# EAGLE design projeto_jcarlos (EAGLE 6.2)
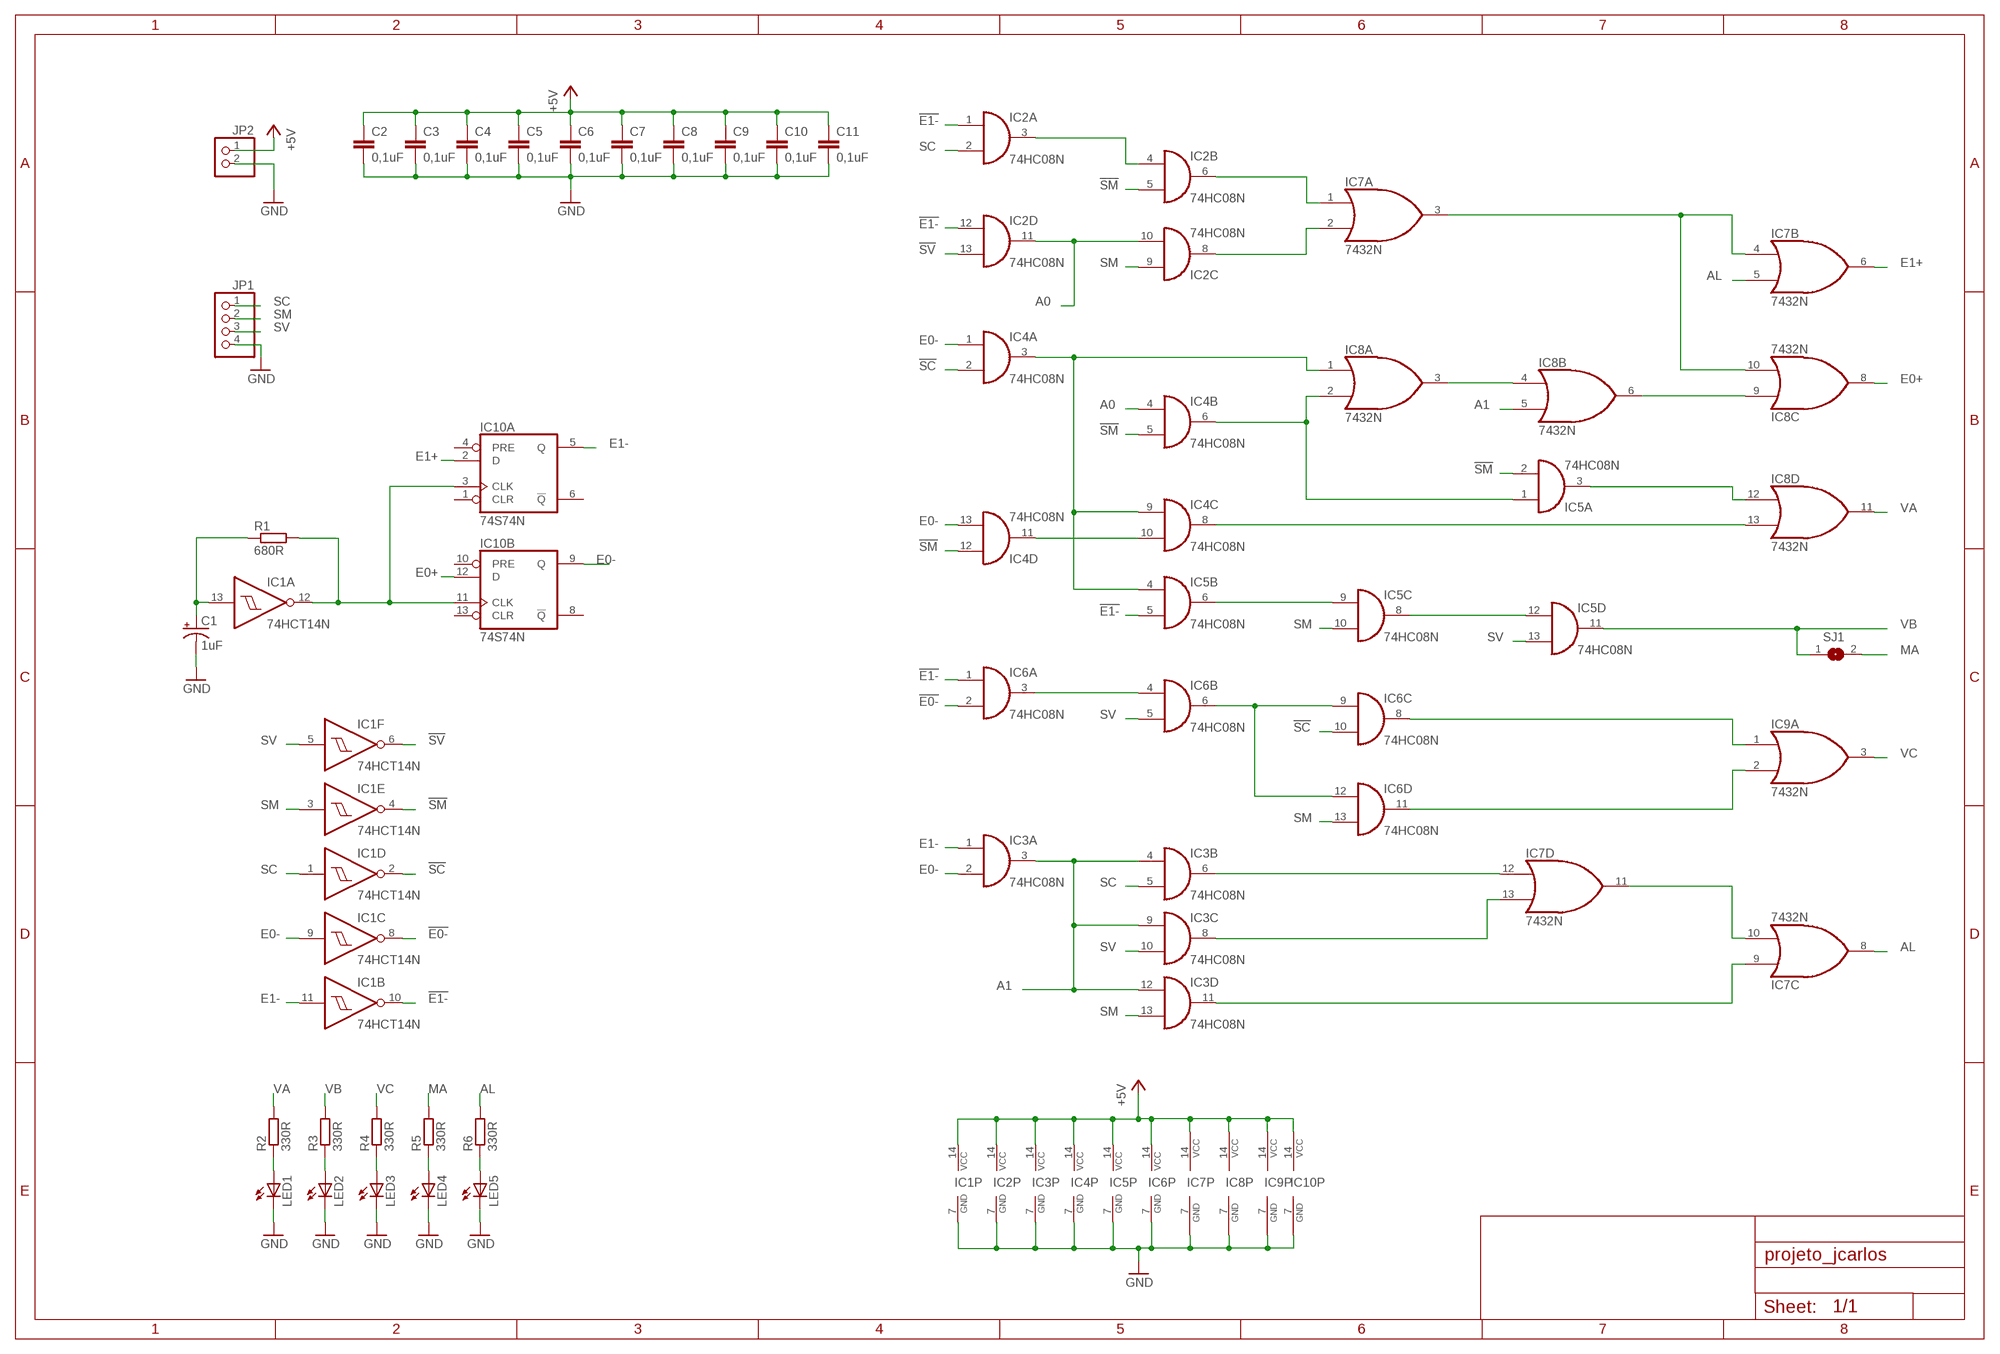
[diagram p0: schematic, sheet 1]

## Parts
C1  1uF  CPOL-USE2.5-5  [E2,5-5]
C2  0,1uF  C-EU025-025X050  [C025-025X050]
C3  0,1uF  C-EU025-025X050  [C025-025X050]
C4  0,1uF  C-EU025-025X050  [C025-025X050]
C5  0,1uF  C-EU025-025X050  [C025-025X050]
C6  0,1uF  C-EU025-025X050  [C025-025X050]
C7  0,1uF  C-EU025-025X050  [C025-025X050]
C8  0,1uF  C-EU025-025X050  [C025-025X050]
C9  0,1uF  C-EU025-025X050  [C025-025X050]
C10  0,1uF  C-EU025-025X050  [C025-025X050]
C11  0,1uF  C-EU025-025X050  [C025-025X050]
IC1  74HCT14N  [DIL14]
IC2  74HC08N  [DIL14]
IC3  74HC08N  [DIL14]
IC4  74HC08N  [DIL14]
IC5  74HC08N  [DIL14]
IC6  74HC08N  [DIL14]
IC7  7432N  [DIL14]
IC8  7432N  [DIL14]
IC9  7432N  [DIL14]
IC10  74S74N  [DIL14]
JP1  PINHD-1X4  [1X04]
JP2  PINHD-1X2  [1X02]
LED1  LED5MM  [LED5MM]
LED2  LED5MM  [LED5MM]
LED3  LED5MM  [LED5MM]
LED4  LED5MM  [LED5MM]
LED5  LED5MM  [LED5MM]
R1  680R  R-EU_0204/5  [0204/5]
R2  330R  R-EU_0204/5  [0204/5]
R3  330R  R-EU_0204/5  [0204/5]
R4  330R  R-EU_0204/5  [0204/5]
R5  330R  R-EU_0204/5  [0204/5]
R6  330R  R-EU_0204/5  [0204/5]
SJ1  SJ  [SJ]

## Nets
!E0-: IC1.8(C:O) IC6.2(A:I1)
!E1-: IC1.10(B:O) IC2.1(A:I0) IC2.12(D:I0) IC5.5(B:I1) IC6.1(A:I0)
!SC: IC1.2(D:O) IC4.2(A:I1) IC6.10(C:I1)
!SM: IC1.4(E:O) IC2.5(B:I1) IC4.5(B:I1) IC4.12(D:I0) IC5.2(A:I1)
!SV: IC1.6(F:O) IC2.13(D:I1)
+5V: C2.1 C3.1 C4.1 C5.1 C6.1 C7.1 C8.1 C9.1 C10.1 C11.1 IC1.14(P:VCC) IC2.14(P:VCC) IC3.14(P:VCC) IC4.14(P:VCC) IC5.14(P:VCC) IC6.14(P:VCC) IC7.14(P:VCC) IC8.14(P:VCC) IC9.14(P:VCC) IC10.14(P:VCC) JP2.1
A0: IC2.10(C:I1) IC2.11(D:O) IC4.4(B:I0)
A1: IC3.3(A:O) IC3.4(B:I0) IC3.9(C:I0) IC3.12(D:I0) IC8.5(B:I1)
AL: IC7.5(B:I1) IC7.8(C:O) R6.2
E0+: IC8.8(C:O) IC10.12(B:D)
E0-: IC1.9(C:I) IC3.2(A:I1) IC4.1(A:I0) IC4.13(D:I1) IC10.9(B:Q)
E1+: IC7.6(B:O) IC10.2(A:D)
E1-: IC1.11(B:I) IC3.1(A:I0) IC10.5(A:Q)
GND: C1.- C2.2 C3.2 C4.2 C5.2 C6.2 C7.2 C8.2 C9.2 C10.2 C11.2 IC1.7(P:GND) IC2.7(P:GND) IC3.7(P:GND) IC4.7(P:GND) IC5.7(P:GND) IC6.7(P:GND) IC7.7(P:GND) IC8.7(P:GND) IC9.7(P:GND) IC10.7(P:GND) JP1.4 JP2.2 LED1.K(C) LED2.K(C) LED3.K(C) LED4.K(C) LED5.K(C)
MA: R5.2 SJ1.2
N$1: IC5.6(B:O) IC5.9(C:I0)
N$2: IC7.3(A:O) IC7.4(B:I0) IC8.10(C:I1)
N$3: IC4.10(C:I1) IC4.11(D:O)
N$4: IC4.8(C:O) IC8.13(D:I1)
N$5: IC8.3(A:O) IC8.4(B:I0)
N$6: IC5.3(A:O) IC8.12(D:I0)
N$7: C1.+ IC1.13(A:I) R1.1
N$8: IC1.12(A:O) IC10.3(A:CLK) IC10.11(B:CLK) R1.2
N$9: IC8.6(B:O) IC8.9(C:I0)
N$10: IC4.3(A:O) IC4.9(C:I0) IC5.4(B:I0) IC8.1(A:I0)
N$11: IC5.8(C:O) IC5.12(D:I0)
N$12: IC4.6(B:O) IC5.1(A:I0) IC8.2(A:I1)
N$13: IC2.3(A:O) IC2.4(B:I0)
N$14: LED1.A R2.1
N$15: IC2.6(B:O) IC7.1(A:I0)
N$16: LED2.A R3.1
N$17: LED3.A R4.1
N$18: IC2.8(C:O) IC7.2(A:I1)
N$19: IC3.6(B:O) IC7.12(D:I0)
N$20: IC3.8(C:O) IC7.13(D:I1)
N$21: IC3.11(D:O) IC7.9(C:I0)
N$22: IC7.10(C:I1) IC7.11(D:O)
N$23: LED4.A R5.1
N$24: LED5.A R6.1
N$27: IC6.3(A:O) IC6.4(B:I0)
N$29: IC6.6(B:O) IC6.9(C:I0) IC6.12(D:I0)
N$32: IC6.8(C:O) IC9.1(A:I0)
N$33: IC6.11(D:O) IC9.2(A:I1)
SC: IC1.1(D:I) IC2.2(A:I1) IC3.5(B:I1) JP1.1
SM: IC1.3(E:I) IC2.9(C:I0) IC3.13(D:I1) IC5.10(C:I1) IC6.13(D:I1) JP1.2
SV: IC1.5(F:I) IC3.10(C:I1) IC5.13(D:I1) IC6.5(B:I1) JP1.3
VA: IC8.11(D:O) R2.2
VB: IC5.11(D:O) R3.2 SJ1.1
VC: IC9.3(A:O) R4.2
Unconnected: IC9.4(B:I0) IC9.5(B:I1) IC9.6(B:O) IC9.8(C:O) IC9.9(C:I0) IC9.10(C:I1) IC9.11(D:O) IC9.12(D:I0) IC9.13(D:I1) IC10.1(A:CLR) IC10.4(A:PRE) IC10.6(A:!Q) IC10.8(B:!Q) IC10.10(B:PRE) IC10.13(B:CLR)

## Library data of the parts
C1 = rcl:CPOL-US: POLARIZED CAPACITOR, American symbol
C2-C11 = rcl:C-EU: CAPACITOR, European symbol
IC1 = 74xx-eu:74*14: Hex schmitt trigger INVERTER
IC2-IC6 = 74xx-eu:74*08: Quad 2-input AND gate
IC7-IC9 = 74xx-us:74*32: Quad 2-input OR gate
IC10 = 74xx-us:74*74: Dual D type positive edge triggered FLIP FLOP, preset and clear
JP1 = pinhead:PINHD-1X4: PIN HEADER
JP2 = pinhead:PINHD-1X2: PIN HEADER
LED1-LED5 = led:LED: LED OSRAM: - CHIPLED LG R971, LG N971, LY N971, LG Q971, LY Q971, LO R971, LY R971 LH N974, LH R974 LS Q976, LO Q976, LY Q976 LO Q996 - Hyper CHIPLED LW Q18S LB Q993, LB Q99A, LB R99A - SideLED LS A670, LO A670, LY A670, LG A670, LP A670 LB A673, LV A673, LT A673, LW A673 LH A674 LY A675 LS A676, LA A676, LO A676, LY A676, LW A676 LS A679, LY A679, LG A679 - Hyper Micro SIDELED® LS Y876, LA Y876, LO Y876, LY Y876 LT Y87S - SmartLED LW L88C, LW L88S LB L89C, LB L89S, LG L890 LS L89K, LO L89K, LY L89K LS L896, LA L896, LO L896, LY L896 - TOPLED LS T670, LO T670, LY T670, LG T670, LP T670 LSG T670, LSP T670, LSY T670, LOP T670, LYG T670 LG T671, LOG T671, LSG T671 LB T673, LV T673, LT T673, LW T673 LH T674 LS T676, LA T676, LO T676, LY T676, LB T676, LH T676, LSB T676, LW T676 LB T67C, LV T67C, LT T67C, LS T67K, LO T67K, LY T67K, LW E67C LS E67B, LA E67B, LO E67B, LY E67B, LB E67C, LV E67C, LT E67C LW T67C LS T679, LY T679, LG T679 LS T770, LO T770, LY T770, LG T770, LP T770 LB T773, LV T773, LT T773, LW T773 LH T774 LS E675, LA E675, LY E675, LS T675 LS T776, LA T776, LO T776, LY T776, LB T776 LHGB T686 LT T68C, LB T68C - Hyper Mini TOPLED® LB M676 - Mini TOPLED Santana® LG M470 LS M47K, LO M47K, LY M47K Source: http://www.osram.convergy.de LUXEON: - LUMILED® LXK2-PW12-R00, LXK2-PW12-S00, LXK2-PW14-U00, LXK2-PW14-V00 LXK2-PM12-R00, LXK2-PM12-S00, LXK2-PM14-U00 LXK2-PE12-Q00, LXK2-PE12-R00, LXK2-PE12-S00, LXK2-PE14-T00, LXK2-PE14-U00 LXK2-PB12-K00, LXK2-PB12-L00, LXK2-PB12-M00, LXK2-PB14-N00, LXK2-PB14-P00, LXK2-PB14-Q00 LXK2-PR12-L00, LXK2-PR12-M00, LXK2-PR14-Q00, LXK2-PR14-R00 LXK2-PD12-Q00, LXK2-PD12-R00, LXK2-PD12-S00 LXK2-PH12-R00, LXK2-PH12-S00 LXK2-PL12-P00, LXK2-PL12-Q00, LXK2-PL12-R00 Source: www.luxeon.com KINGBRIGHT: KA-3528ASYC Source: www.kingbright.com
R1-R6 = rcl:R-EU_: RESISTOR, European symbol
SJ1 = jumper:SJ: SMD solder JUMPER

## Board
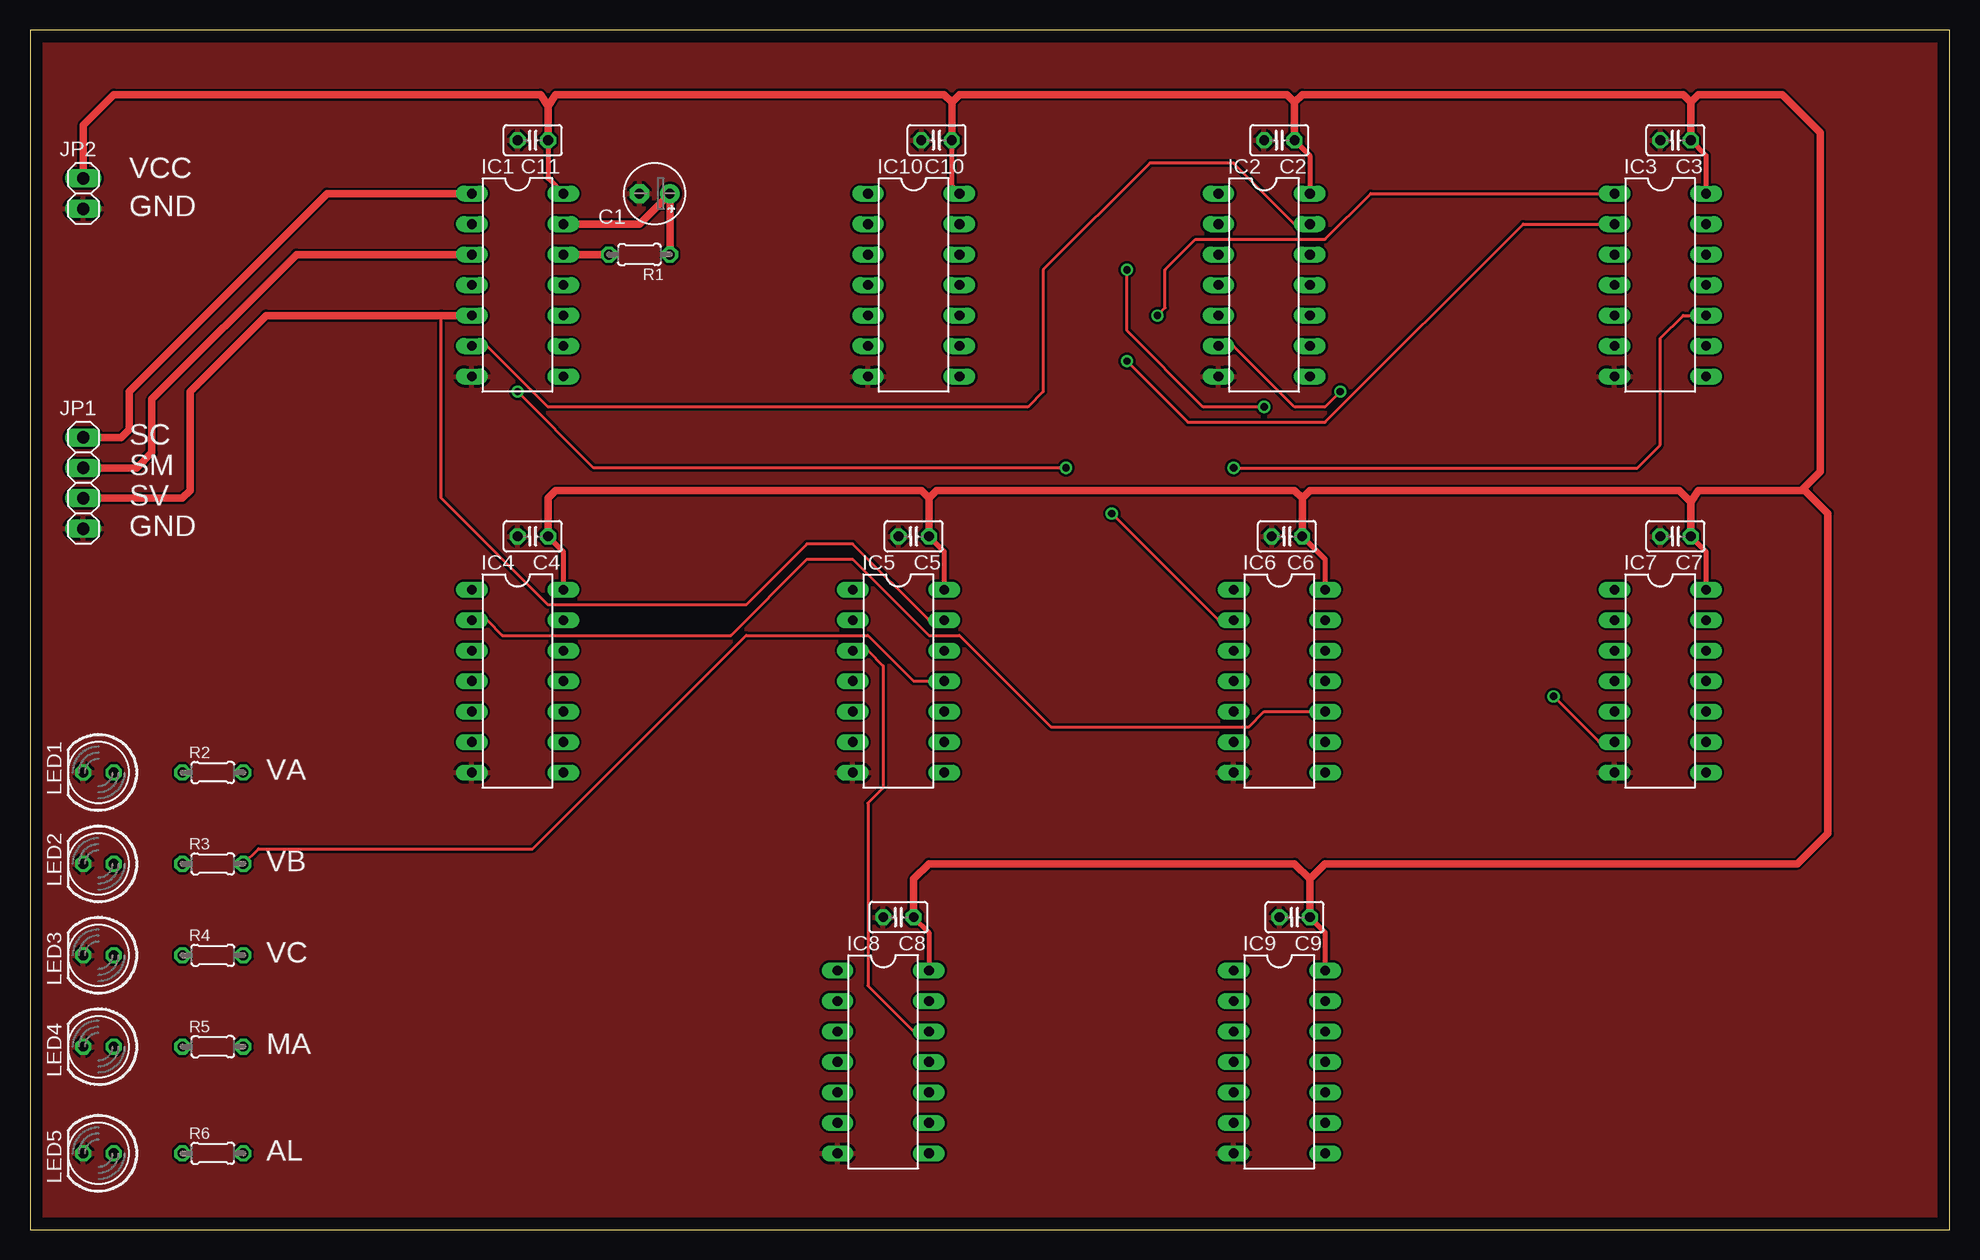
[diagram p1: board, top side]
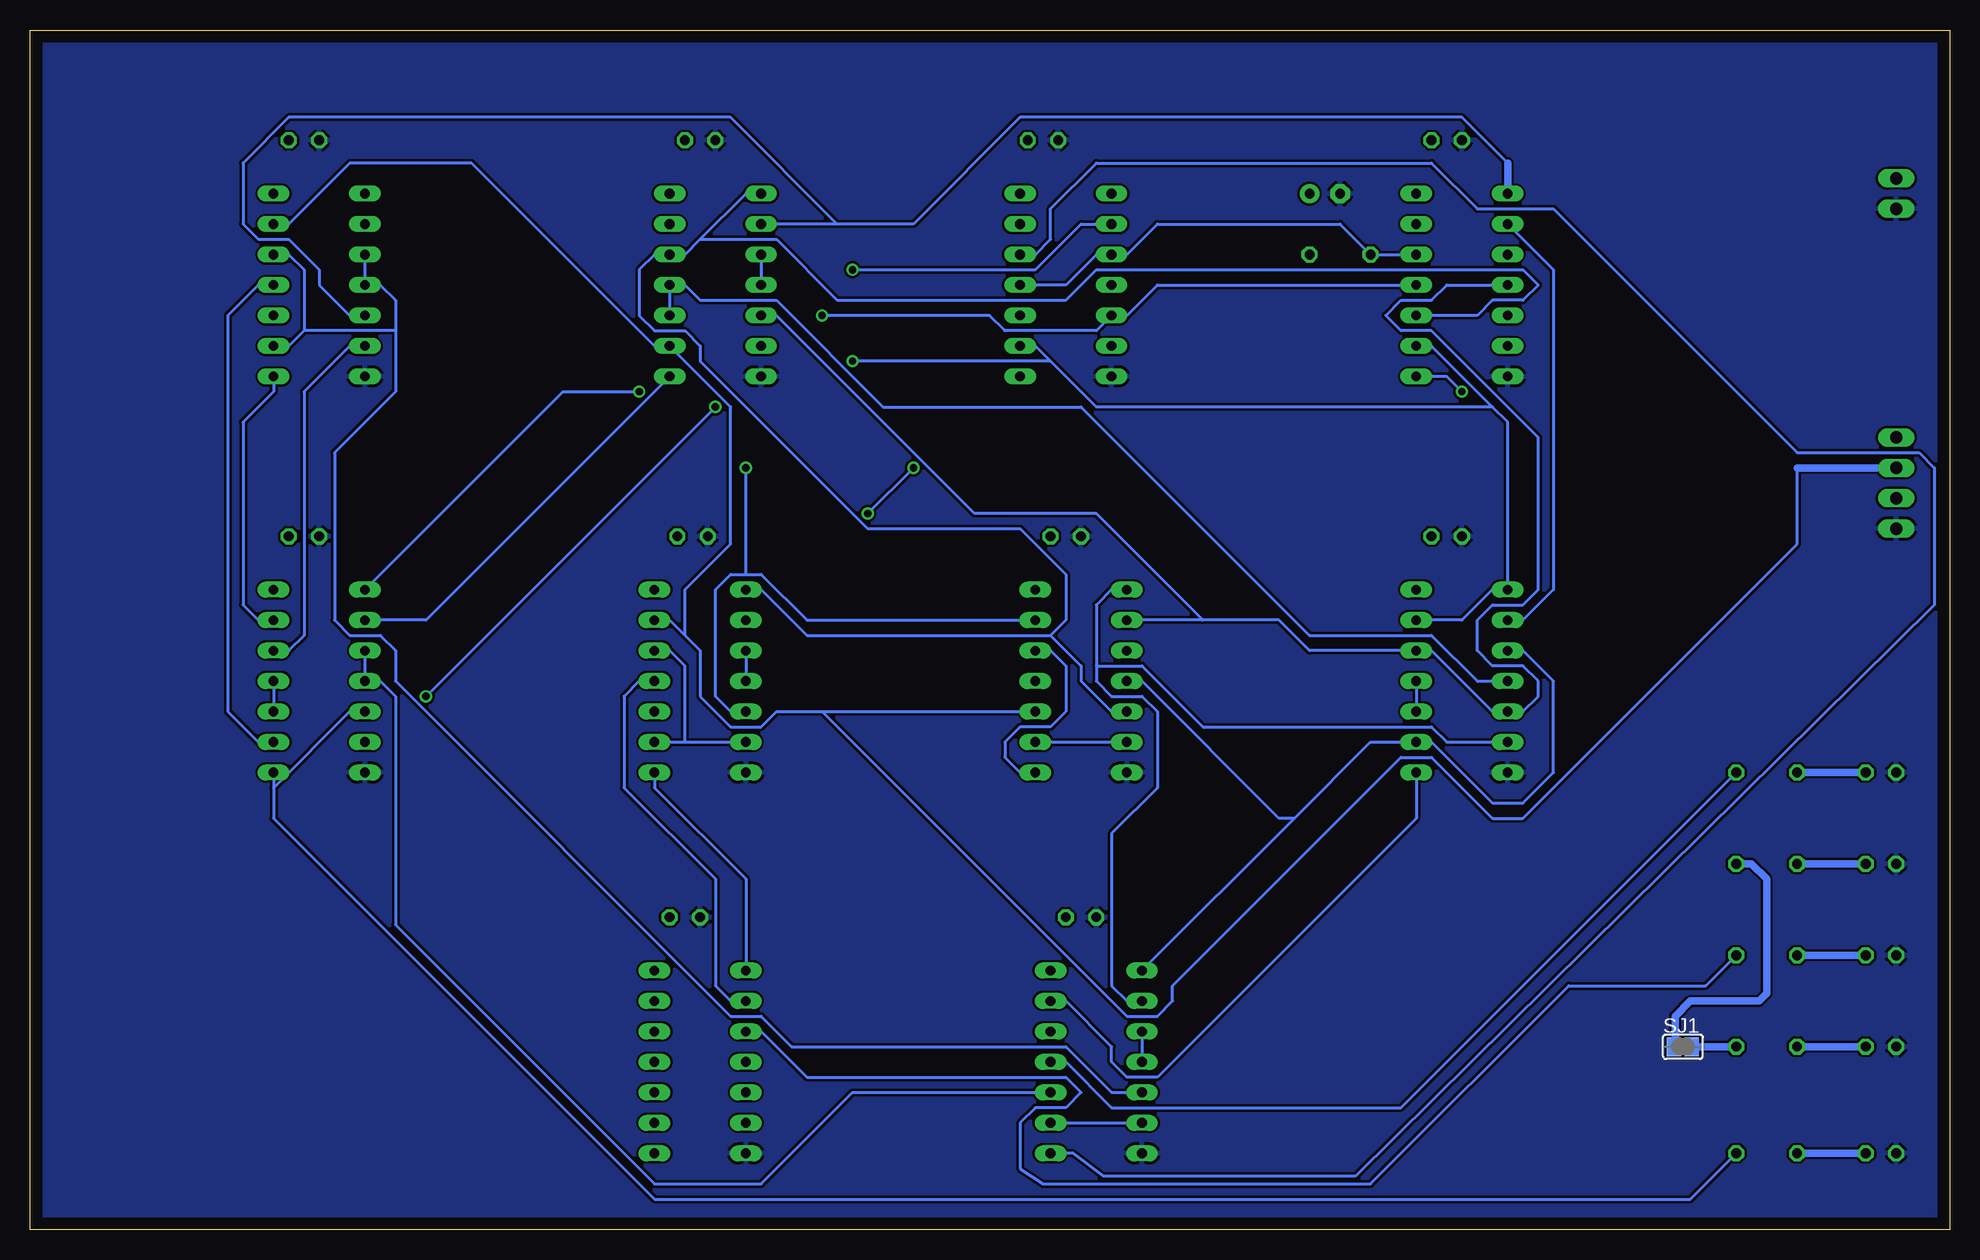
[diagram p2: board, bottom side, seen from below]

Size 160 x 100 mm. Coordinates in mm from the lower left corner, seen from the top.
Outline: 0,0 160,0 160,100 0,100 0,0
Copper layers (1*16): Top 0.035mm / dielectric 1.5mm / Bottom 0.035mm
Design rules: minimum track width 10mil, minimum drill 24mil, track to track 8mil, track to pad 8mil, pad to pad 8mil, via to via 8mil, smd to smd 8mil, copper to edge 40mil, drill to drill 8mil, minimum pad ring 10mil, minimum via ring 8mil, stop-mask expansion 4mil, vias tented up to drill 0mil, thermal gap 10mil

### Footprints (pad centres in the part's own frame; a part is rotated, then mirrored left to right if it is on the bottom)
E2,5-5 = drill 0.813 pad 1.6: + -1.27,0 | drill 0.813 pad 1.6 octagon: - 1.27,0
C025-025X050 = drill 0.813 octagon: 1 -1.27,0; 2 1.27,0
DIL14 = drill 0.813 long: 1 -7.62,-3.81; 2 -5.08,-3.81; 3 -2.54,-3.81; 4 0,-3.81; 5 2.54,-3.81; 6 5.08,-3.81; 7 7.62,-3.81; 8 7.62,3.81; 9 5.08,3.81; 10 2.54,3.81; 11 0,3.81; 12 -2.54,3.81; 13 -5.08,3.81; 14 -7.62,3.81
1X04 = drill 1.016 long: 1 -3.81,0; 2 -1.27,0; 3 1.27,0; 4 3.81,0
1X02 = drill 1.016 long: 1 -1.27,0; 2 1.27,0
LED5MM = drill 0.813 octagon: A -1.27,0; K 1.27,0
0204/5 = drill 0.813 octagon: 1 -2.54,0; 2 2.54,0
SJ = smd 1.168 x 1.6: 1 -0.762,0; 2 0.762,0

### Placement (x,y rotation side)
C1  52.07,86.36 180 top
C2  104.14,90.81 180 top
C3  137.16,90.81 180 top
C4  41.91,57.78 180 top
C5  73.66,57.78 180 top
C6  104.78,57.78 180 top
C7  137.16,57.78 180 top
C8  72.39,26.04 180 top
C9  105.41,26.04 180 top
C10  75.56,90.81 180 top
C11  41.91,90.81 180 top
IC1  40.64,78.74 270 top
IC2  102.87,78.74 270 top
IC3  135.89,78.74 270 top
IC4  40.64,45.72 270 top
IC5  72.39,45.72 270 top
IC6  104.14,45.72 270 top
IC7  135.89,45.72 270 top
IC8  71.12,13.97 270 top
IC9  104.14,13.97 270 top
IC10  73.66,78.74 270 top
JP1  4.45,62.23 270 top
JP2  4.45,86.36 270 top
LED1  5.71,38.1 180 top
LED2  5.71,30.48 180 top
LED3  5.71,22.86 180 top
LED4  5.71,15.24 180 top
LED5  5.71,6.35 180 top
R1  50.8,81.28 180 top
R2  15.24,38.1 0 top
R3  15.24,30.48 0 top
R4  15.24,22.86 0 top
R5  15.24,15.24 0 top
R6  15.24,6.35 0 top
SJ1  22.23,15.24 0 bottom

### Tracks (layer width: path | path; a pad name or v marks a point on that pad's centre or on a via)
!E0-  (via drill 0.61)
  Top 0.254: v40.64,69.85 46.99,63.5 v86.36,63.5 | v90.17,59.69 99.06,50.8 IC6.2
  Bottom 0.254: IC1.8 41.91,71.12 v40.64,69.85 | v90.17,59.69 v86.36,63.5
!E1-
  Bottom 0.254: IC5.5 69.85,43.18 72.39,45.72 72.39,46.99 74.93,49.53 | 74.93,49.53 95.25,49.53 99.06,53.34 IC6.1 | IC1.10 39.37,76.2 38.1,77.47 35.56,77.47 34.29,78.74 35.56,80.01 71.12,80.01 73.66,77.47 92.71,77.47 97.79,82.55 104.14,82.55 | 104.14,82.55 105.41,81.28 IC2.12 107.95,81.28 109.22,80.01 109.22,76.2 107.95,74.93 105.41,74.93 104.14,73.66 104.14,72.39 90.17,58.42 77.47,58.42 73.66,54.61 73.66,50.8 74.93,49.53 | IC2.1 100.33,86.36 104.14,82.55
!SC
  Top 0.254: IC6.10 102.87,43.18 101.6,41.91 85.09,41.91 77.47,49.53 74.93,49.53 68.58,55.88 64.77,55.88 58.42,49.53 39.37,49.53 38.1,50.8 IC4.2
  Bottom 0.254: IC4.2 35.56,50.8 33.02,53.34 33.02,80.01 IC1.2
!SM
  Bottom 0.254: 62.23,50.8 55.88,50.8 53.34,48.26 IC4.12 43.18,48.26 38.1,43.18 IC4.5 35.56,43.18 34.29,44.45 34.29,45.72 35.56,46.99 38.1,46.99 39.37,48.26 39.37,50.8 38.1,52.07 35.56,52.07 34.29,53.34 34.29,66.04 43.18,74.93 45.72,74.93 46.99,76.2 45.72,77.47 43.18,77.47 41.91,78.74 IC1.4 | 62.23,50.8 IC5.2 | IC2.5 97.79,76.2 81.28,59.69 71.12,59.69 62.23,50.8
!SV
  Top 0.254: IC1.6 38.1,73.66 43.18,68.58 78.74,68.58 83.19,68.58 84.45,69.85 84.45,80.01 93.34,88.9 93.98,88.9 99.06,88.9 100.33,88.9 105.41,83.82 IC2.13
+5V
  Top 0.406: C11.1 43.18,87.63 IC1.14 | IC10.14 76.83,87 C10.1 | C2.1 106.68,89.53 IC2.14 | C3.1 139.7,89.53 IC3.14 | C7.1 139.7,56.52 IC7.14 | C6.1 107.95,55.88 IC6.14 | C5.1 76.2,56.52 IC5.14 | C4.1 44.45,56.52 IC4.14 | C8.1 74.93,24.77 IC8.14 | C9.1 107.95,24.77 IC9.14
  Top 0.61: JP2.1 4.45,92.08 6.99,94.61 42.55,94.61 43.18,93.66 | 43.18,93.66 C11.1 | C2.1 105.41,93.98 | 105.41,93.98 104.78,94.61 77.47,94.61 76.83,93.98 | 76.83,93.98 76.2,94.61 43.81,94.61 43.18,93.66 | C10.1 76.83,93.98 | 138.43,93.98 137.79,94.61 106.05,94.61 105.41,93.98 | 138.43,93.98 C3.1 | C7.1 138.43,60.64 | 138.43,60.64 139.06,61.59 147.64,61.59 | 147.64,61.59 149.22,63.18 149.22,91.44 146.05,94.61 139.06,94.61 138.43,93.98 | C6.1 106.05,60.96 | 106.05,60.96 106.68,61.59 137.48,61.59 138.43,60.64 | C5.1 74.93,60.96 | 74.93,60.96 75.56,61.59 105.41,61.59 106.05,60.96 | C4.1 43.18,60.96 43.81,61.59 74.3,61.59 74.93,60.96 | C9.1 106.68,29.21 | 106.68,29.21 107.95,30.48 147.32,30.48 149.86,33.02 149.86,59.69 147.96,61.59 147.64,61.59 | C8.1 73.66,29.21 74.93,30.48 105.41,30.48 106.68,29.21
A0
  Bottom 0.254: IC4.4 39.37,45.72 43.18,49.53 53.34,49.53 72.39,68.58 88.9,68.58 97.79,77.47 104.14,77.47 105.41,78.74 IC2.11 IC2.10
A1
  Bottom 0.254: IC3.9 138.43,73.66 137.16,74.93 | 137.16,74.93 137.16,80.01 138.43,81.28 IC3.12 | IC8.5 69.85,11.43 73.66,15.24 96.52,15.24 99.06,17.78 101.6,17.78 129.54,45.72 129.54,48.26 130.81,49.53 133.35,49.53 134.62,50.8 134.62,64.77 129.54,69.85 129.54,74.93 | 129.54,74.93 129.54,77.47 130.81,78.74 IC3.4 IC3.3 | 129.54,74.93 137.16,74.93
AL
  Bottom 0.254: R6.2 21.59,2.54 107.95,2.54 139.7,34.29 139.7,36.83 | IC7.8 139.7,36.83 | IC7.5 133.35,43.18 139.7,36.83
E0+
  Bottom 0.254: IC8.8 73.03,6.35 70.48,4.45 49.53,4.45 1.27,52.07 1.27,63.5 2.54,64.77 12.7,64.77 33.02,85.09 39.37,85.09 43.18,88.9 71.12,88.9 74.93,85.09 74.93,82.55 76.2,81.28 IC10.12
E0-  (via drill 0.61)
  Top 0.254: IC3.2 124.46,83.82 107.95,67.31 96.52,67.31 v91.44,72.39
  Bottom 0.254: IC4.13 40.64,50.8 38.1,53.34 IC4.1 36.83,67.31 38.1,68.58 | IC1.9 43.18,73.66 38.1,68.58 | IC10.9 76.2,73.66 74.93,72.39 | 74.93,72.39 71.12,68.58 38.1,68.58 | 74.93,72.39 v91.44,72.39
E1+  (via drill 0.61)
  Top 0.254: v91.44,80.01 91.44,74.93 97.79,68.58 v102.87,68.58 | v127,44.45 130.81,40.64 IC7.6
  Bottom 0.254: IC10.2 72.39,83.82 76.2,80.01 v91.44,80.01 | v127,44.45 v102.87,68.58
E1-  (via drill 0.61)
  Top 0.254: IC3.1 111.76,86.36 107.95,82.55 97.16,82.55 94.61,80.01 94.61,76.83 v93.98,76.2
  Bottom 0.254: IC1.11 66.04,78.74 68.58,76.2 IC10.5 71.12,74.93 78.74,74.93 80.01,76.2 v93.98,76.2
GND
  pour Bottom: 0,100.97 161.29,100.97 161.29,-1.27 -1.27,-1.27 -1.27,100.97
  pour Top: -1.27,101.6 160.02,101.6 160.02,-1.27 -1.27,-1.27
MA
  Bottom 0.61: R5.2 SJ1.2
N$1
  Bottom 0.254: IC5.9 IC5.6
N$2
  Bottom 0.254: IC8.10 91.44,11.43 99.06,3.81 107.95,3.81 129.54,25.4 129.54,44.45 130.81,45.72 IC7.4 IC7.3
N$3
  Bottom 0.254: IC4.11 IC4.10
N$4
  Bottom 0.254: IC8.13 73.66,19.05 69.85,15.24 69.85,13.97 68.58,12.7 66.04,12.7 44.45,34.29 IC4.8
N$5
  Bottom 0.254: IC8.3 IC8.4
N$6
  Top 0.254: IC8.12 73.66,16.51 69.85,20.32 69.85,35.56 71.12,36.83 71.12,46.99 69.85,48.26 IC5.3
N$7
  Top 0.61: R1.1 C1.+ 50.8,83.82 IC1.13
N$8
  Top 0.61: R1.2 IC1.12
  Bottom 0.254: IC1.12 R1.2 50.8,83.82 66.04,83.82 68.58,81.28 IC10.3 71.12,81.28 73.66,78.74 IC10.11
N$9
  Bottom 0.254: IC8.9 IC8.6
N$10
  Bottom 0.254: IC8.1 54.61,34.29 | 54.61,34.29 48.26,40.64 IC4.9 43.18,40.64 38.1,35.56 35.56,35.56 33.02,38.1 33.02,45.72 35.56,48.26 IC4.3 | IC5.4 67.31,45.72 55.88,34.29 54.61,34.29
N$11
  Bottom 0.254: IC5.8 77.47,38.1 78.74,39.37 78.74,40.64 77.47,41.91 74.93,41.91 73.66,43.18 73.66,46.99 74.93,48.26 IC5.12
N$12
  Bottom 0.254: IC8.2 68.58,19.05 69.85,20.32 69.85,33.02 66.04,36.83 66.04,43.18 67.31,44.45 69.85,44.45 71.12,45.72 71.12,46.99 | 71.12,46.99 71.12,52.07 69.85,53.34 IC5.1 | IC4.6 41.91,40.64 43.18,41.91 62.23,41.91 67.31,46.99 71.12,46.99
N$13
  Bottom 0.254: IC2.3 IC2.4
N$14
  Bottom 0.61: LED1.A R2.1
N$15  (via drill 0.61)
  Top 0.254: IC2.6 100.33,73.66 105.41,68.58 107.95,68.58 v109.22,69.85
  Bottom 0.254: v109.22,69.85 115.57,69.85 IC7.1
N$16
  Bottom 0.61: LED2.A R3.1
N$17
  Bottom 0.61: LED3.A R4.1
N$18
  Bottom 0.254: IC7.2 127,50.8 IC2.8
N$19
  Bottom 0.254: IC7.12 138.43,48.26 137.16,49.53 137.16,69.85 133.35,73.66 IC3.6
N$20
  Bottom 0.254: IC7.13 140.97,50.8 142.24,52.07 142.24,67.31 139.7,69.85 IC3.8
N$21
  Bottom 0.254: IC7.9 140.97,40.64 143.51,43.18 143.51,76.2 140.97,78.74 IC3.11
N$22
  Bottom 0.254: IC7.11 IC7.10
N$23
  Bottom 0.61: LED4.A R5.1
N$24
  Bottom 0.61: LED5.A R6.1
N$27
  Bottom 0.254: IC6.3 IC6.4
N$29
  Bottom 0.254: IC6.9 105.41,40.64 | 105.41,40.64 IC6.6 | IC6.12 106.68,48.26 105.41,46.99 105.41,40.64
N$32
  Bottom 0.254: IC9.1 100.33,29.21 107.95,36.83 IC6.8
N$33
  Bottom 0.254: IC9.2 101.6,19.05 102.87,20.32 102.87,29.21 110.49,36.83 110.49,44.45 109.22,45.72 IC6.11
SC
  Top 0.61: JP1.1 7.62,66.04 8.26,66.67 8.26,69.85 24.77,86.36 IC1.1
  Bottom 0.254: 92.71,83.82 86.36,83.82 77.47,92.71 40.64,92.71 36.83,88.9 | 92.71,83.82 IC2.2 | IC3.5 133.35,76.2 135.89,78.74 135.89,80.01 138.43,82.55 140.97,82.55 142.24,83.82 142.24,88.9 138.43,92.71 101.6,92.71 92.71,83.82
  Bottom 0.61: IC1.1 36.83,88.9
SM
  Top 0.61: JP1.2 8.89,63.5 10.16,64.77 10.16,69.22 22.23,81.28 IC1.3
  Bottom 0.254: 93.98,43.18 97.79,43.18 99.06,41.91 101.6,41.91 104.14,44.45 104.14,48.26 105.41,49.53 | 93.98,43.18 IC5.10 | 105.41,49.53 106.68,50.8 IC6.13 | 105.41,49.53 105.41,53.34 101.6,57.15 101.6,68.58 IC2.9 107.95,73.66 123.19,88.9 133.35,88.9 138.43,83.82 IC3.13 | 12.7,63.5 12.7,57.15 35.56,34.29 38.1,34.29 43.18,39.37 45.72,39.37 64.77,20.32 64.77,19.05 66.04,17.78 68.58,17.78 93.98,43.18
  Bottom 0.61: JP1.2 12.7,63.5
SV  (via drill 0.61)
  Top 0.254: IC3.10 137.79,76.2 135.89,74.3 135.89,65.41 133.99,63.5 v100.33,63.5 | 34.29,76.2 34.29,60.96 43.18,52.07 59.69,52.07 64.77,57.15 68.58,57.15 74.93,50.8 IC5.13
  Top 0.61: JP1.3 12.7,60.96 13.34,61.59 13.34,69.85 19.68,76.2 34.29,76.2 IC1.5
  Bottom 0.254: IC5.13 95.25,50.8 99.06,54.61 100.33,54.61 | 100.33,54.61 101.6,54.61 102.87,53.34 102.87,44.45 101.6,43.18 IC6.5 | 100.33,54.61 v100.33,63.5
VA
  Bottom 0.254: R2.2 45.72,10.16 69.85,10.16 73.66,13.97 IC8.11
VB
  Top 0.254: IC5.11 73.66,45.72 69.85,49.53 59.69,49.53 41.91,31.75 19.05,31.75 R3.2
  Bottom 0.61: SJ1.1 22.86,15.37 22.86,17.78 21.59,19.05 15.88,19.05 15.24,19.68 15.24,29.21 16.51,30.48 R3.2
VC
  Bottom 0.254: R4.2 20.32,20.32 31.75,20.32 48.26,3.81 75.56,3.81 77.47,5.08 77.47,8.89 76.2,10.16 73.66,10.16 72.39,11.43 73.66,12.7 95.25,12.7 99.06,16.51 IC9.3

### Text on the board
tNames: VCC | GND | SC | SM | SV | GND | VA | VB | VC | MA | AL